# Altium schematic sheet Master-Slave.SchDoc: NEOS Master/Slave Electronics
size D; PageSetup: Record=PageOptions|CenterHorizontal=True|CenterVertical=True|PrintScale=0.34|XCorrection=1.00|YCorrection=1.00|PrintKind=1|BorderSize=5000000|LeftOffset=0|BottomOffset=0|Orientation=2|PaperLength=1000|PaperWidth=1000|Scale=100|PaperSource=15|PrintQuality=1200|MediaType=1|DitherType=10|PaperKind=Letter|PrintScaleMode=1
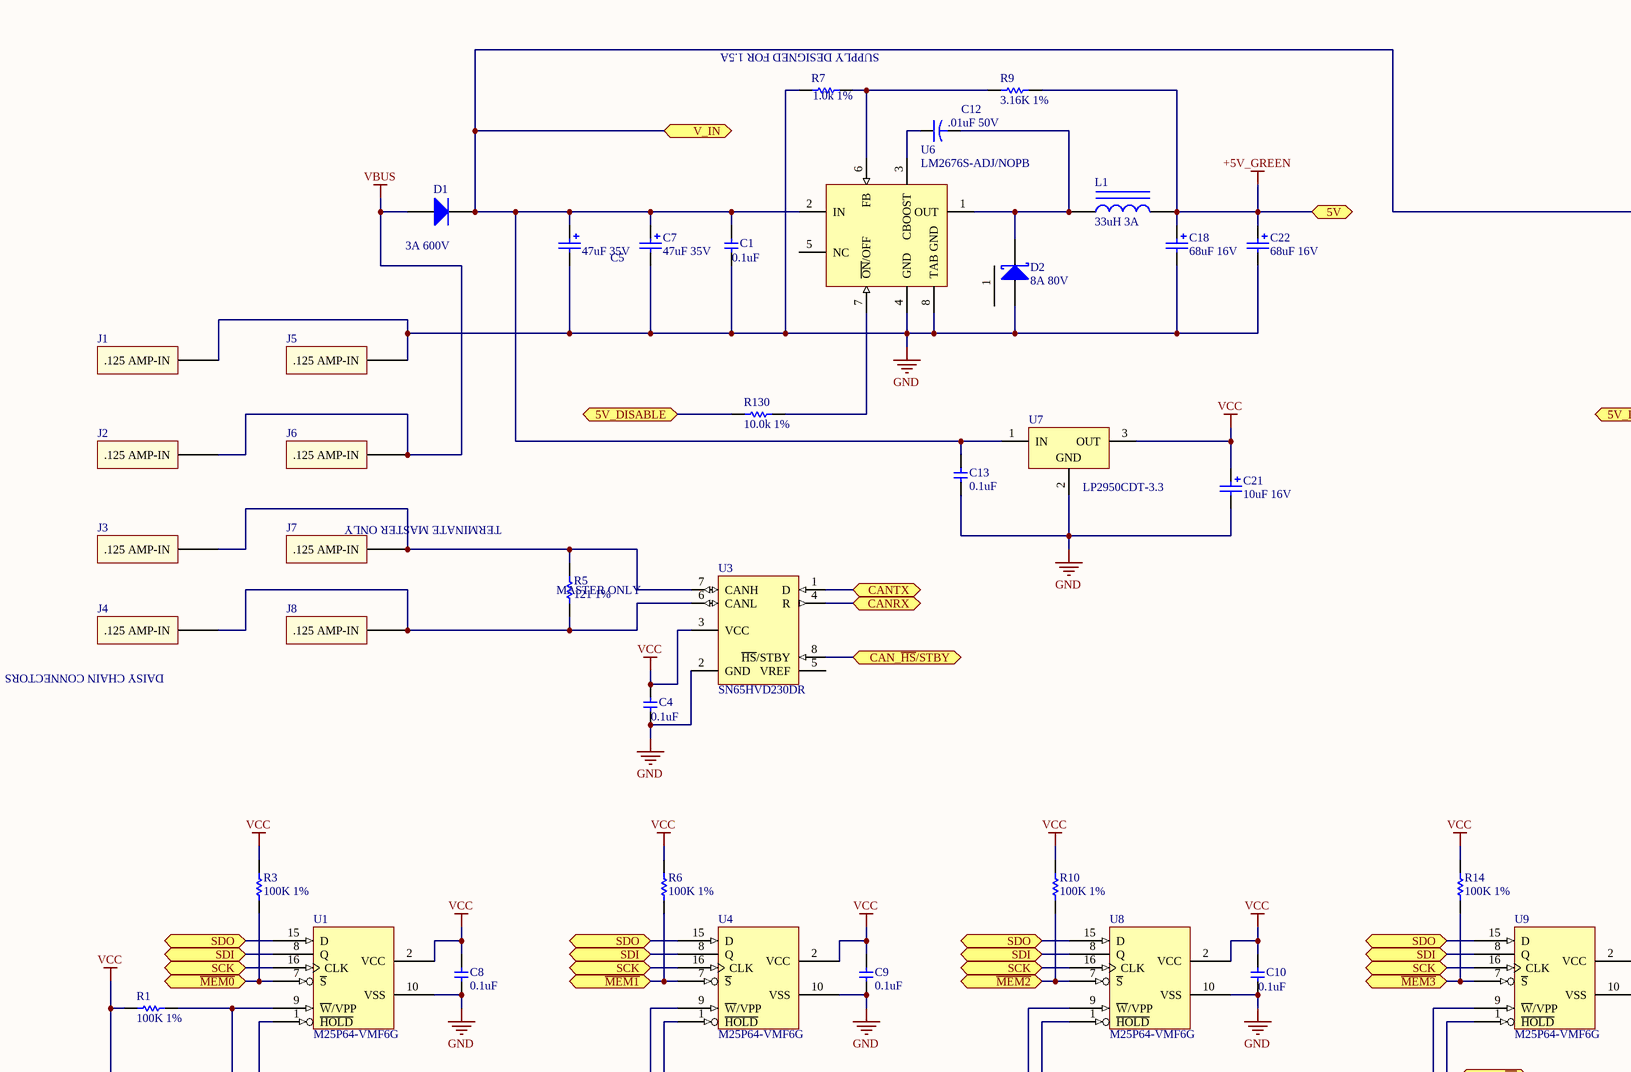
[diagram p0: Master-Slave.SchDoc, top left]
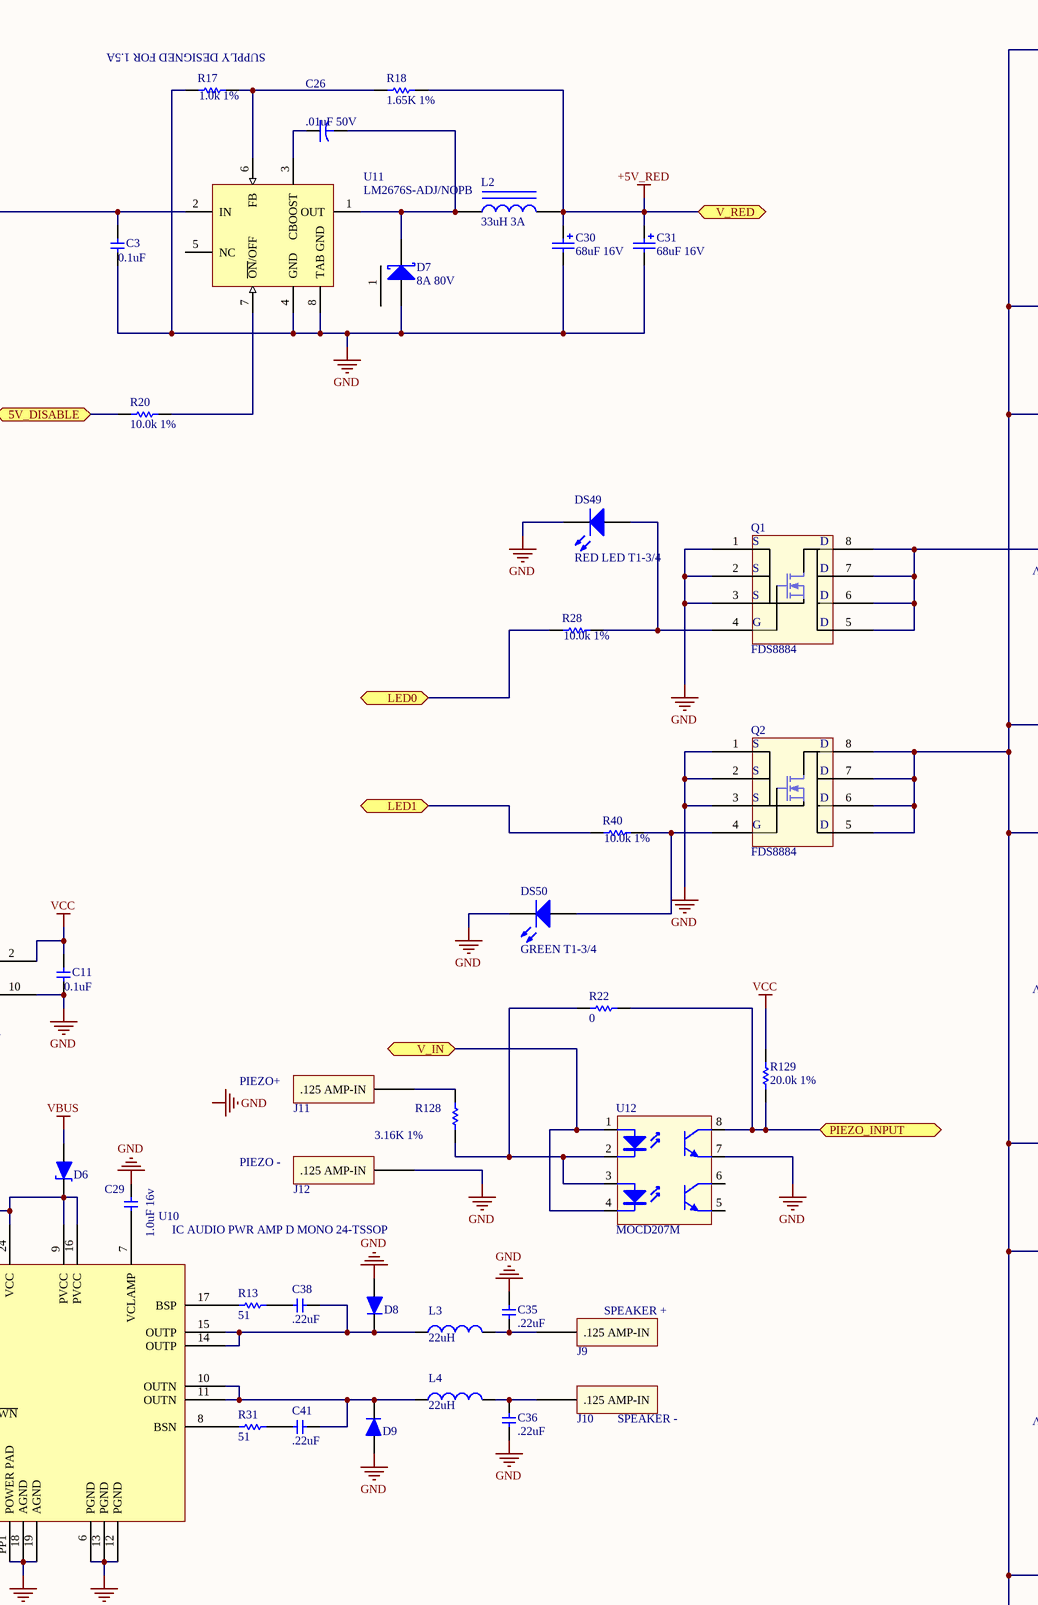
[diagram p1: Master-Slave.SchDoc, top middle]
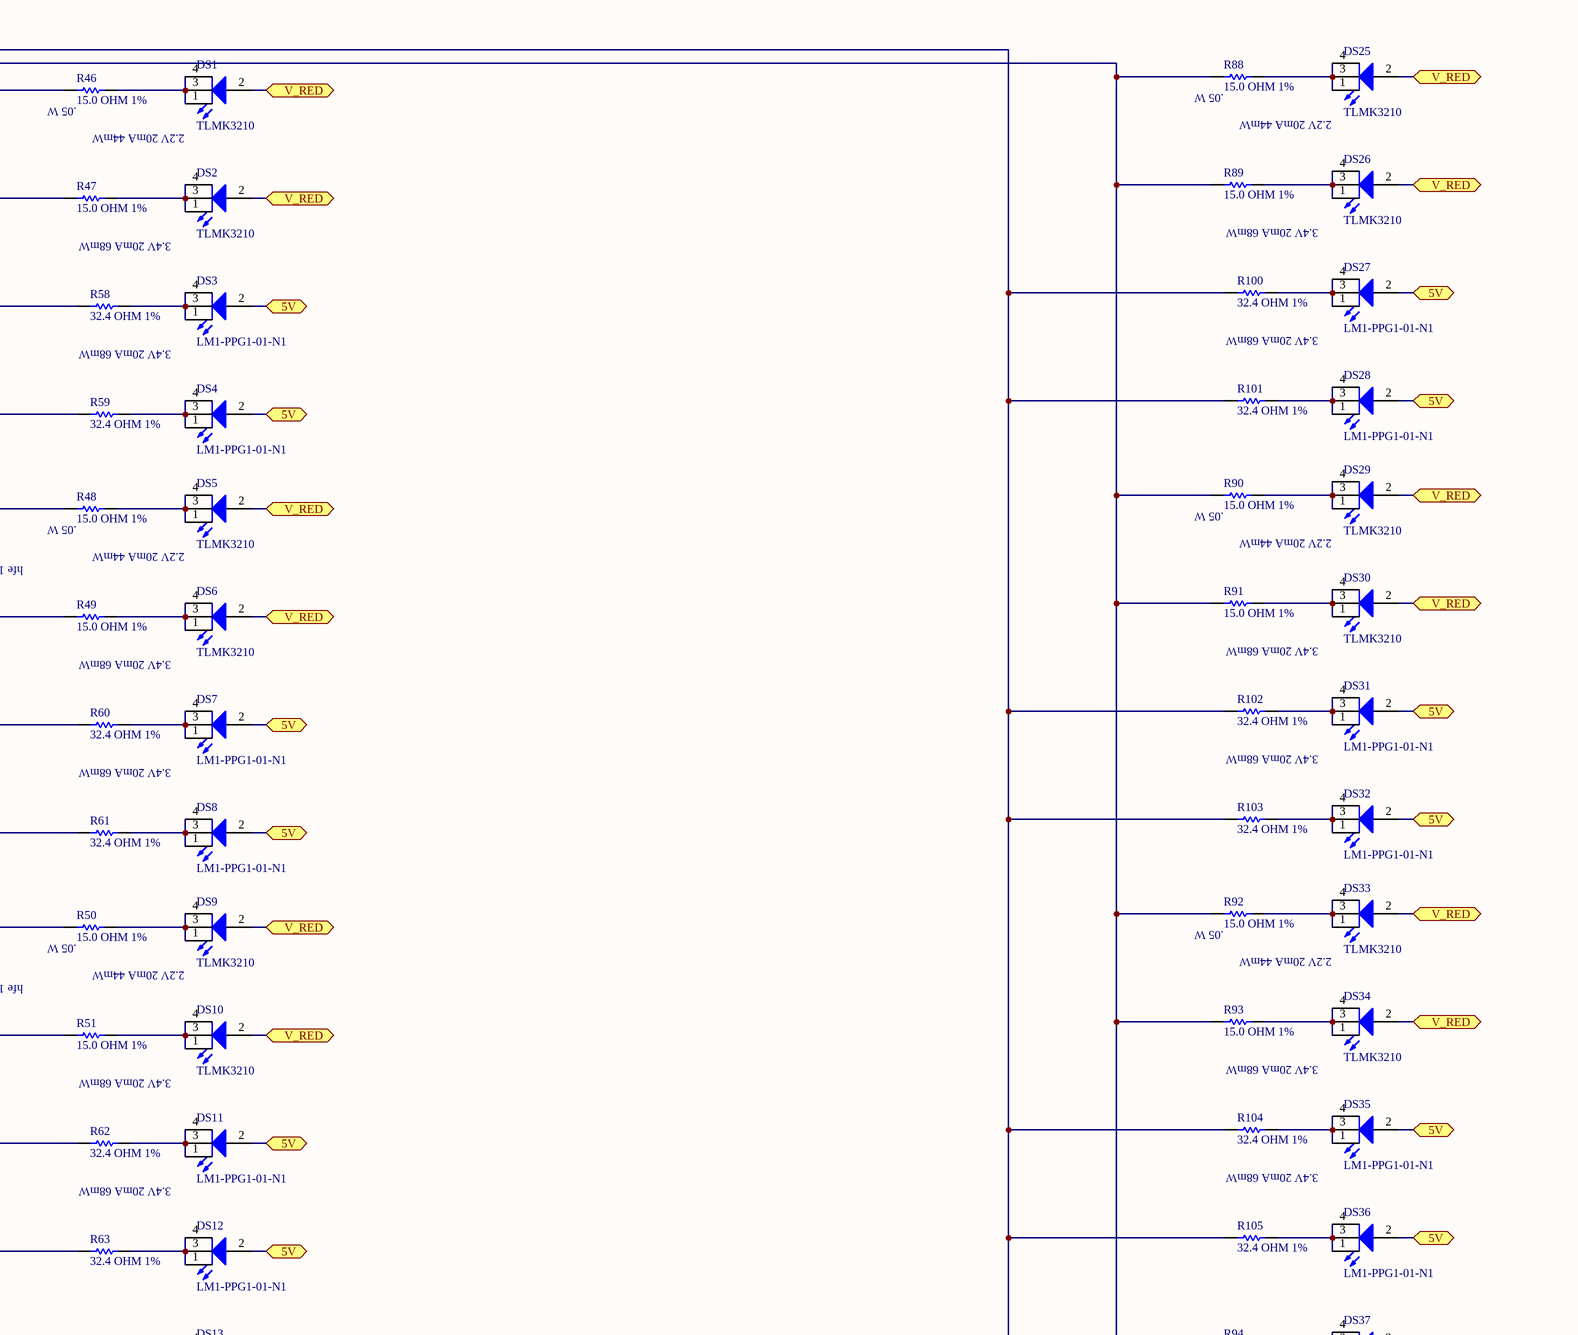
[diagram p2: Master-Slave.SchDoc, top right]
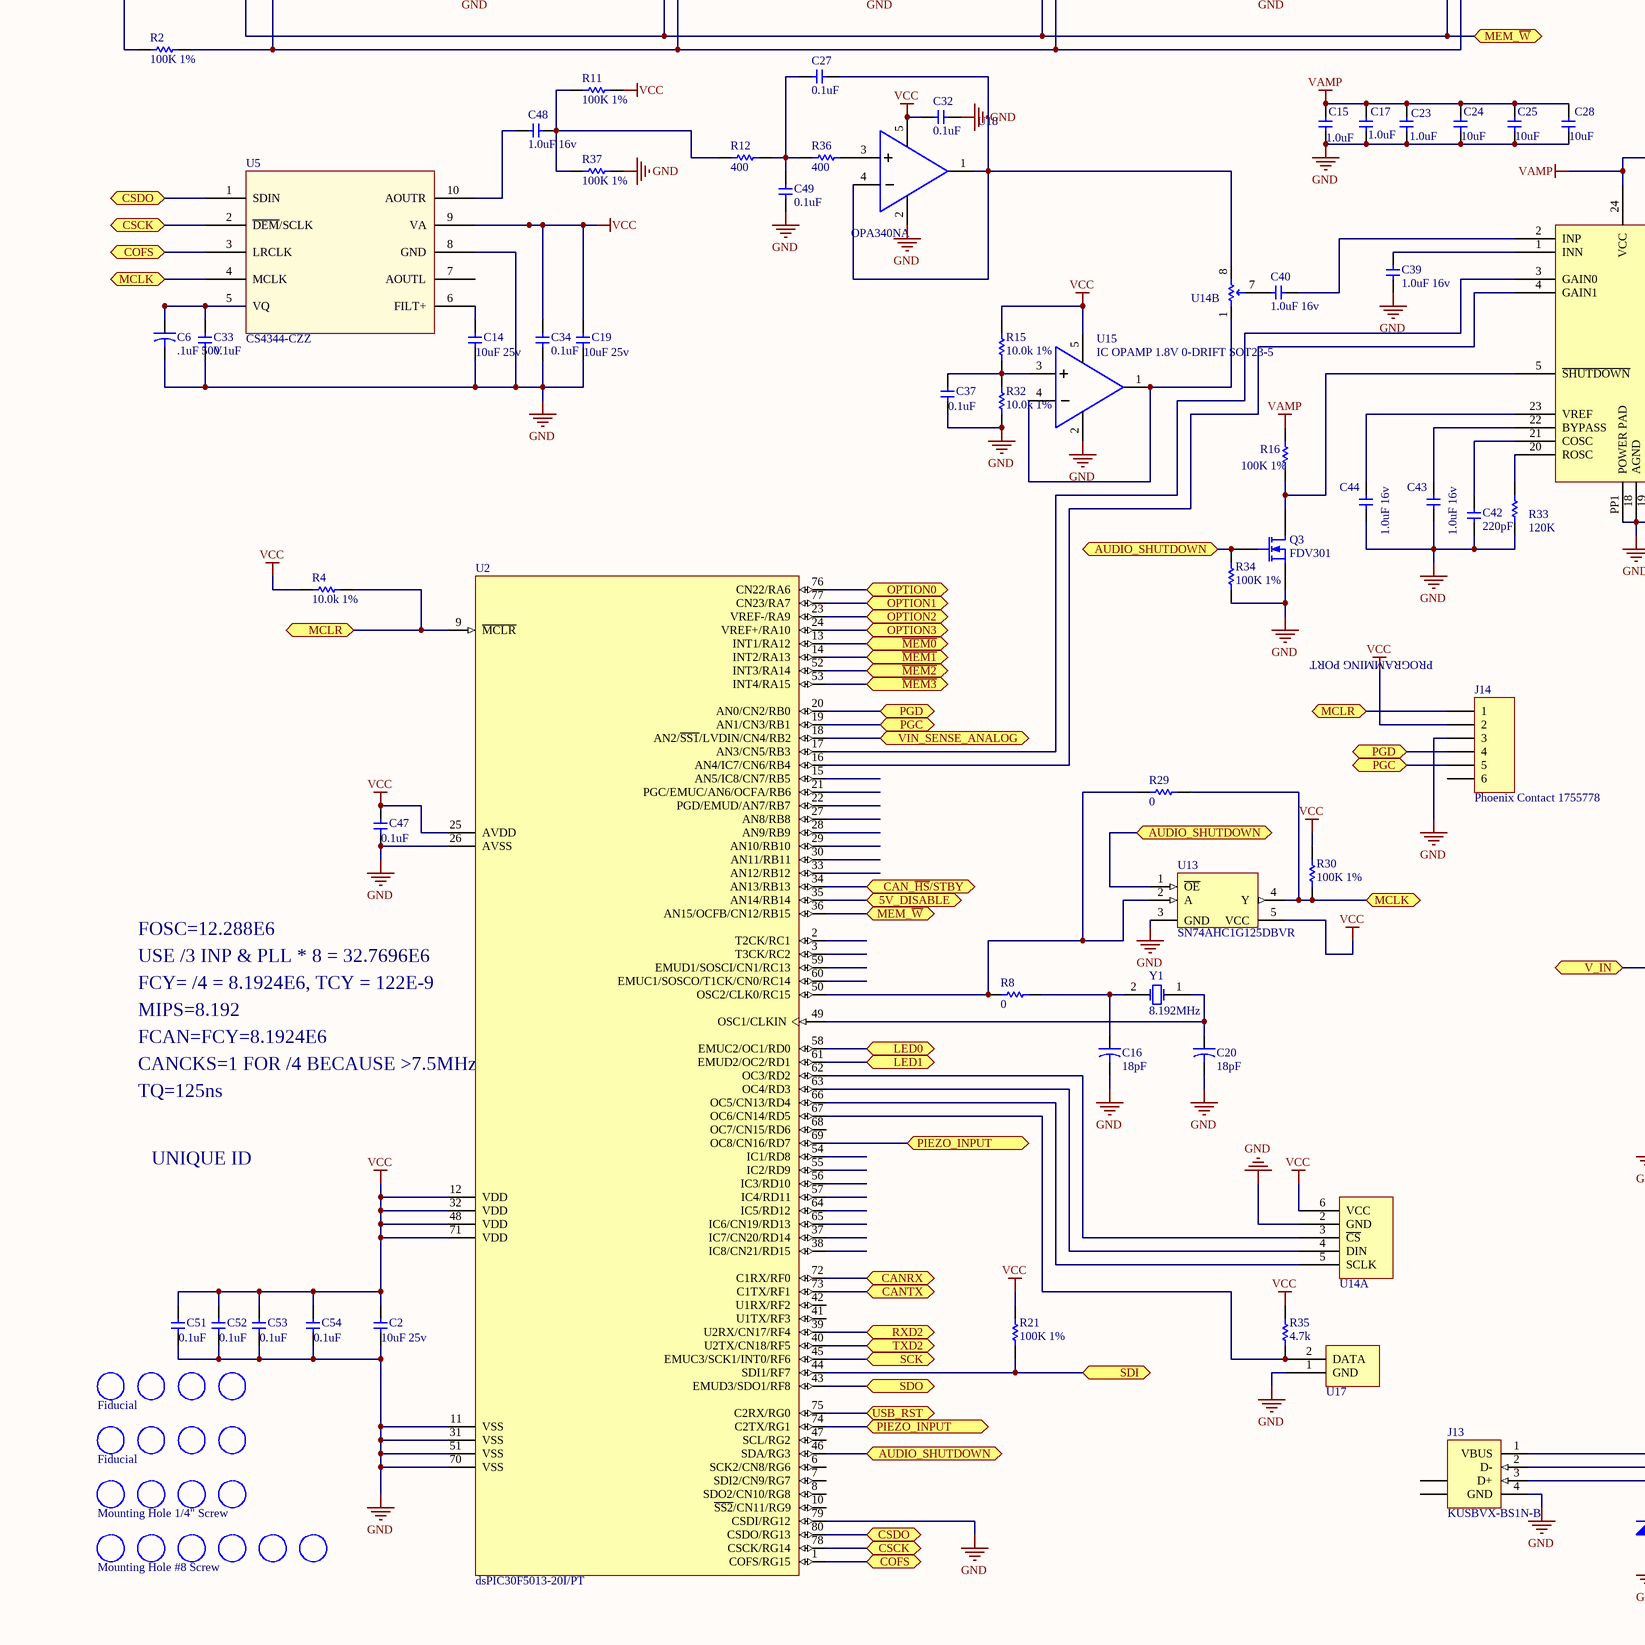
[diagram p3: Master-Slave.SchDoc, bottom left]
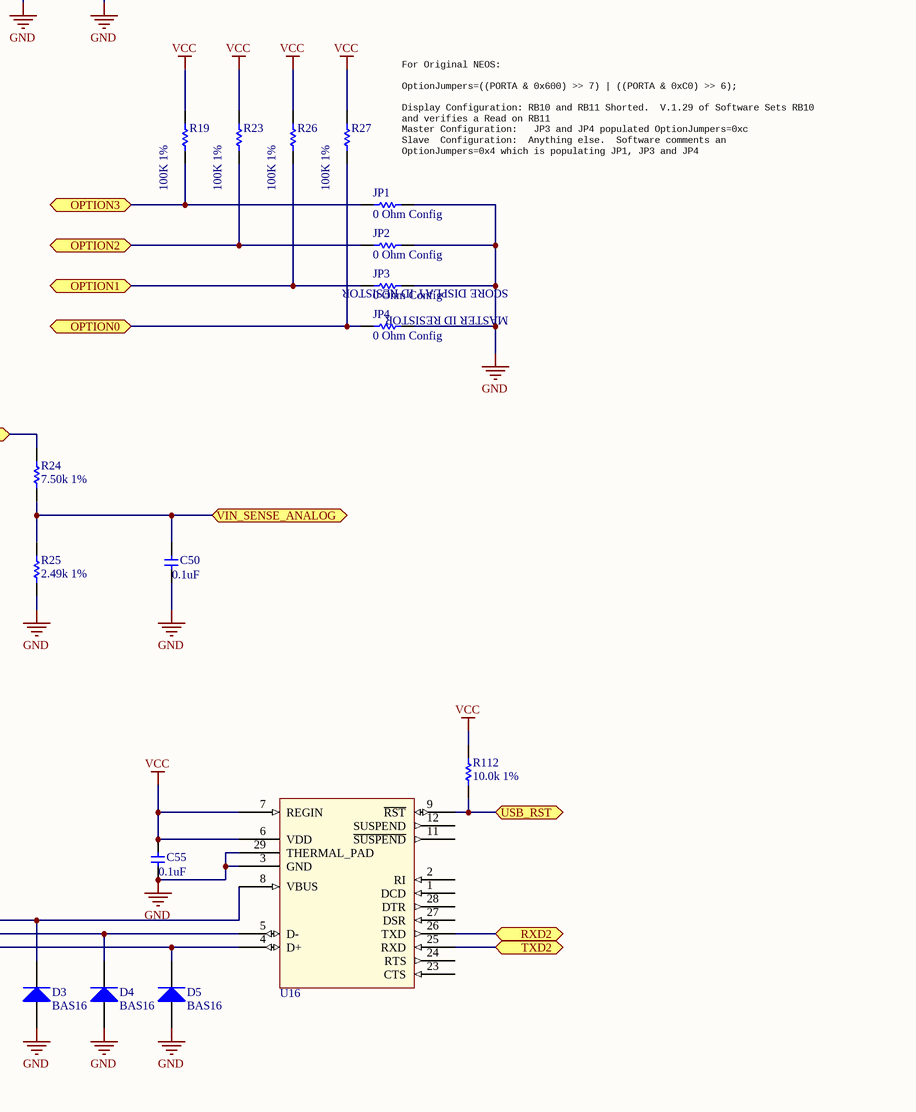
[diagram p4: Master-Slave.SchDoc, bottom middle]
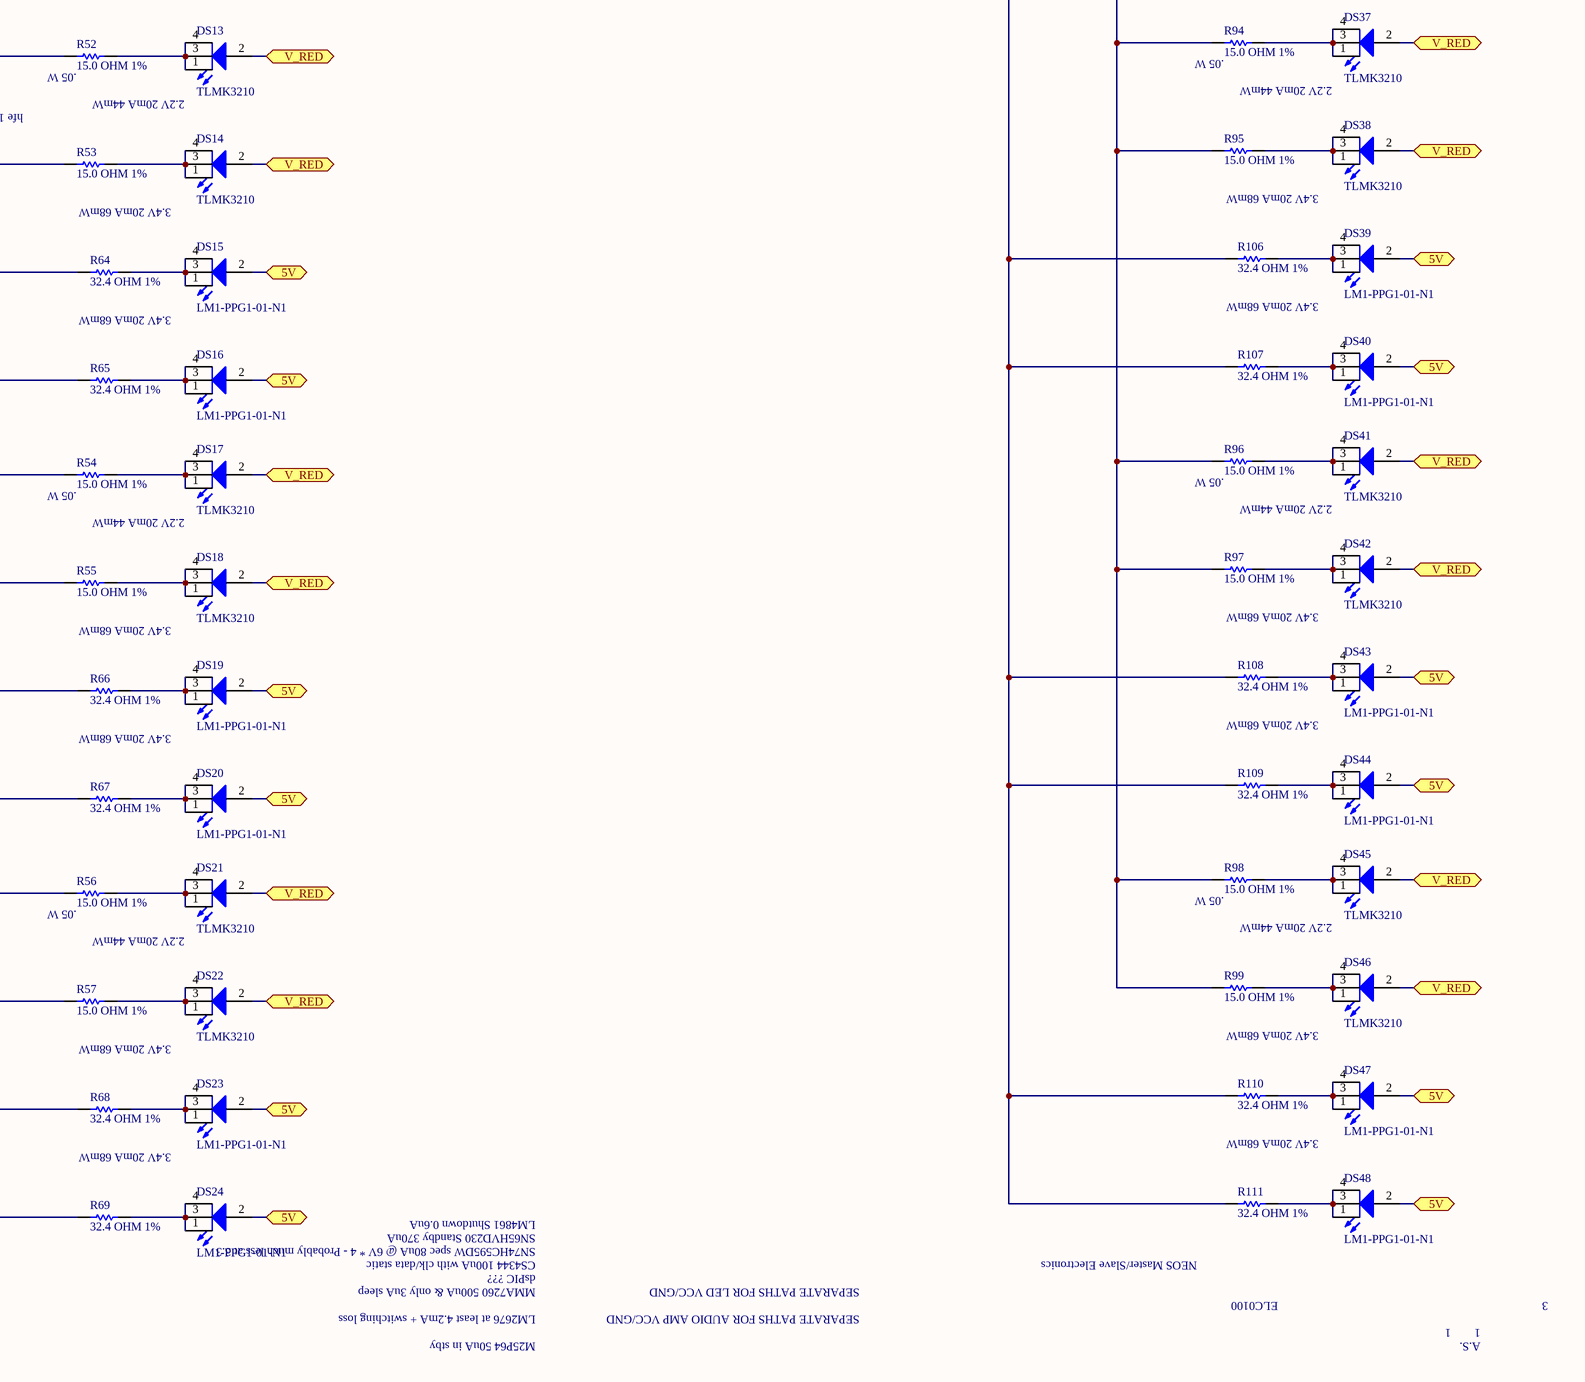
[diagram p5: Master-Slave.SchDoc, bottom right]

## Parts
C1  value 0.1uF  [C0603]  (hidden comment: CAP CER .1UF 25V 10% X7R 0603)
C2  value 10uF 25v  [C1206]  (hidden comment: CAP CER 10UF 25V X5R 1206)
C3  value 0.1uF  [C0603]  (hidden comment: CAP CER .1UF 25V 10% X7R 0603)
C4  value 0.1uF  [C0603]  (hidden comment: CAP CER .1UF 25V 10% X7R 0603)
C5  47uF 35V  [CAPACITOR TANT 47UF 35V 10% SMD 7343-43 (EIA]
C6  .1uF 50V  [C0805]
C7  47uF 35V  [CAPACITOR TANT 47UF 35V 10% SMD 7343-43 (EIA]
C8  value 0.1uF  [C0603]  (hidden comment: CAP CER .1UF 25V 10% X7R 0603)
C9  value 0.1uF  [C0603]  (hidden comment: CAP CER .1UF 25V 10% X7R 0603)
C10  value 0.1uF  [C0603]  (hidden comment: CAP CER .1UF 25V 10% X7R 0603)
C11  value 0.1uF  [C0603]  (hidden comment: CAP CER .1UF 25V 10% X7R 0603)
C12  .01uF 50V  [C0805]
C13  value 0.1uF  [C0603]  (hidden comment: CAP CER .1UF 25V 10% X7R 0603)
C14  value 10uF 25v  [C1206]  (hidden comment: CAP CER 10UF 25V X5R 1206)
C15  value 1.0uF  [C0805]  (hidden comment: CAP CER 1.0UF 16V 20% X7R 08055)
C16  18pF  [C0805]
C17  value 1.0uF  [C0805]  (hidden comment: CAP CER 1.0UF 16V 20% X7R 08055)
C18  68uF 16V  [C7343]
C19  value 10uF 25v  [C1206]  (hidden comment: CAP CER 10UF 25V X5R 1206)
C20  18pF  [C0805]
C21  10uF 16V  [C4X5.8]
C22  68uF 16V  [C7343]
C23  value 1.0uF  [C0805]  (hidden comment: CAP CER 1.0UF 16V 20% X7R 08055)
C24  value 10uF  [C1206]  (hidden comment: CAP CER 10UF 25V X5R 1206)
C25  value 10uF  [C1206]  (hidden comment: CAP CER 10UF 25V X5R 1206)
C26  .01uF 50V  [C0805]
C27  value 0.1uF  [C0603]  (hidden comment: CAP CER .1UF 25V 10% X7R 0603)
C28  value 10uF  [C1206]  (hidden comment: CAP CER 10UF 25V X5R 1206)
C29  value 1.0uF 16v  [C0805]  (hidden comment: CAP CER 1.0UF 16V 20% X7R 08055)
C30  68uF 16V  [D]
C31  68uF 16V  [C7343]
C32  value 0.1uF  [C0603]  (hidden comment: CAP CER .1UF 25V 10% X7R 0603)
C33  value 0.1uF  [C0603]  (hidden comment: CAP CER .1UF 25V 10% X7R 0603)
C34  value 0.1uF  [C0603]  (hidden comment: CAP CER .1UF 25V 10% X7R 0603)
C35  value .22uF  [C0805]  (hidden comment: CAP .22UF 25V CERAMIC X7R 0805)
C36  value .22uF  [C0805]  (hidden comment: CAP .22UF 25V CERAMIC X7R 0805)
C37  value 0.1uF  [C0603]  (hidden comment: CAP CER .1UF 25V 10% X7R 0603)
C38  value .22uF  [C0805]  (hidden comment: CAP .22UF 25V CERAMIC X7R 0805)
C39  value 1.0uF 16v  [C0805]  (hidden comment: CAP CER 1.0UF 16V 20% X7R 08055)
C40  value 1.0uF 16v  [C0805]  (hidden comment: CAP CER 1.0UF 16V 20% X7R 08055)
C41  value .22uF  [C0805]  (hidden comment: CAP .22UF 25V CERAMIC X7R 0805)
C42  value 220pF  [C0603]  (hidden comment: CAP CER 220PF 50V 5% C0G 0603)
C43  value 1.0uF 16v  [C0805]  (hidden comment: CAP CER 1.0UF 16V 20% X7R 08055)
C44  value 1.0uF 16v  [C0805]  (hidden comment: CAP CER 1.0UF 16V 20% X7R 08055)
C47  value 0.1uF  [C0603]  (hidden comment: CAP CER .1UF 25V 10% X7R 0603)
C48  value 1.0uF 16v  [C0805]  (hidden comment: CAP CER 1.0UF 16V 20% X7R 08055)
C49  value 0.1uF  [C0603]  (hidden comment: CAP CER .1UF 25V 10% X7R 0603)
C50  value 0.1uF  [C0603]  (hidden comment: CAP CER .1UF 25V 10% X7R 0603)
C51  value 0.1uF  [C0603]  (hidden comment: CAP CER .1UF 25V 10% X7R 0603)
C52  value 0.1uF  [C0603]  (hidden comment: CAP CER .1UF 25V 10% X7R 0603)
C53  value 0.1uF  [C0603]  (hidden comment: CAP CER .1UF 25V 10% X7R 0603)
C54  value 0.1uF  [C0603]  (hidden comment: CAP CER .1UF 25V 10% X7R 0603)
C55  value 0.1uF  [C0603]  (hidden comment: CAP CER .1UF 25V 10% X7R 0603)
D1  value 3A 600V  [DIODE_SMC]  (hidden comment: DIODE ULTRA FAST 3A 600V SMC)
D2  8A 80V  [D2PAK]
D3  BAS16  [SOT23]
D4  BAS16  [SOT23]
D5  BAS16  [SOT23]
D6  DIODE SCHOTTKY 3A 50V SMA  [SMA]  (value not drawn)
D7  8A 80V  [D2PAK]
D8  DIODE ULTRA FAST 2A 100V SMA  [SMA]  (value not drawn)
D9  DIODE ULTRA FAST 2A 100V SMA  [SMA]  (value not drawn)
DS1  TLMK3210  [L#S/TLMK3210Z]
DS2  TLMK3210  [L#S/TLMK3210Z]
DS3  LM1-PPG1-01-N1  [L#S/TLMK3210Z]
DS4  LM1-PPG1-01-N1  [L#S/TLMK3210Z]
DS5  TLMK3210  [L#S/TLMK3210Z]
DS6  TLMK3210  [L#S/TLMK3210Z]
DS7  LM1-PPG1-01-N1  [L#S/TLMK3210Z]
DS8  LM1-PPG1-01-N1  [L#S/TLMK3210Z]
DS9  TLMK3210  [L#S/TLMK3210Z]
DS10  TLMK3210  [L#S/TLMK3210Z]
DS11  LM1-PPG1-01-N1  [L#S/TLMK3210Z]
DS12  LM1-PPG1-01-N1  [L#S/TLMK3210Z]
DS13  TLMK3210  [L#S/TLMK3210Z]
DS14  TLMK3210  [L#S/TLMK3210Z]
DS15  LM1-PPG1-01-N1  [L#S/TLMK3210Z]
DS16  LM1-PPG1-01-N1  [L#S/TLMK3210Z]
DS17  TLMK3210  [L#S/TLMK3210Z]
DS18  TLMK3210  [L#S/TLMK3210Z]
DS19  LM1-PPG1-01-N1  [L#S/TLMK3210Z]
DS20  LM1-PPG1-01-N1  [L#S/TLMK3210Z]
DS21  TLMK3210  [L#S/TLMK3210Z]
DS22  TLMK3210  [L#S/TLMK3210Z]
DS23  LM1-PPG1-01-N1  [L#S/TLMK3210Z]
DS24  LM1-PPG1-01-N1  [L#S/TLMK3210Z]
DS25  TLMK3210  [L#S/TLMK3210Z]
DS26  TLMK3210  [L#S/TLMK3210Z]
DS27  LM1-PPG1-01-N1  [L#S/TLMK3210Z]
DS28  LM1-PPG1-01-N1  [L#S/TLMK3210Z]
DS29  TLMK3210  [L#S/TLMK3210Z]
DS30  TLMK3210  [L#S/TLMK3210Z]
DS31  LM1-PPG1-01-N1  [L#S/TLMK3210Z]
DS32  LM1-PPG1-01-N1  [L#S/TLMK3210Z]
DS33  TLMK3210  [L#S/TLMK3210Z]
DS34  TLMK3210  [L#S/TLMK3210Z]
DS35  LM1-PPG1-01-N1  [L#S/TLMK3210Z]
DS36  LM1-PPG1-01-N1  [L#S/TLMK3210Z]
DS37  TLMK3210  [L#S/TLMK3210Z]
DS38  TLMK3210  [L#S/TLMK3210Z]
DS39  LM1-PPG1-01-N1  [L#S/TLMK3210Z]
DS40  LM1-PPG1-01-N1  [L#S/TLMK3210Z]
DS41  TLMK3210  [L#S/TLMK3210Z]
DS42  TLMK3210  [L#S/TLMK3210Z]
DS43  LM1-PPG1-01-N1  [L#S/TLMK3210Z]
DS44  LM1-PPG1-01-N1  [L#S/TLMK3210Z]
DS45  TLMK3210  [L#S/TLMK3210Z]
DS46  TLMK3210  [L#S/TLMK3210Z]
DS47  LM1-PPG1-01-N1  [L#S/TLMK3210Z]
DS48  LM1-PPG1-01-N1  [L#S/TLMK3210Z]
DS49  RED LED T1-3/4  [LED T1-3/4 Flush]
DS50  GREEN T1-3/4  [LED T1-3/4 Flush]
FID1  Fiducial  [Fiducial]  (no BOM)
FID2  Fiducial  [Fiducial]  (value not drawn)  (no BOM)
FID3  Fiducial  [Fiducial]  (value not drawn)  (no BOM)
FID4  Fiducial  [Fiducial]  (value not drawn)  (no BOM)
FID5  Fiducial  [Fiducial]  (no BOM)
FID6  Fiducial  [Fiducial]  (value not drawn)  (no BOM)
FID7  Fiducial  [Fiducial]  (value not drawn)  (no BOM)
FID8  Fiducial  [Fiducial]  (value not drawn)  (no BOM)
J1  *  [WIRE_125]  (value not drawn)  (no BOM)
J2  *  [WIRE_125]  (value not drawn)  (no BOM)
J3  *  [WIRE_125]  (value not drawn)  (no BOM)
J4  *  [WIRE_125]  (value not drawn)  (no BOM)
J5  *  [WIRE_125]  (value not drawn)  (no BOM)
J6  *  [WIRE_125]  (value not drawn)  (no BOM)
J7  *  [WIRE_125]  (value not drawn)  (no BOM)
J8  *  [WIRE_125]  (value not drawn)  (no BOM)
J9  *  [WIRE_125]  (value not drawn)  (no BOM)
J10  *  [WIRE_125]  (value not drawn)  (no BOM)
J11  *  [WIRE_125]  (value not drawn)  (no BOM)
J12  *  [WIRE_125]  (value not drawn)  (no BOM)
J13  KUSBVX-BS1N-B  [KUSBVX-BS1N]
J14  Phoenix Contact 1755778  [JCPM5086VE0Z]
JP1  0 Ohm Config
JP2  0 Ohm Config
JP3  0 Ohm Config
JP4  0 Ohm Config  [0805]
L1  33uH 3A  [IND/DO5022]
L2  33uH 3A  [IND/DO5022]
L3  value 22uH  [PANASONIC_ELL]  (hidden comment: COIL 22UH 900MA CHOKE SMD)
L4  value 22uH  [PANASONIC_ELL]  (hidden comment: COIL 22UH 900MA CHOKE SMD)
M1  Mounting Hole 1/4" Screw  [MHole250]  (no BOM)
M2  Mounting Hole 1/4" Screw  [MHole250]  (value not drawn)  (no BOM)
M3  Mounting Hole 1/4" Screw  [MHole250]  (value not drawn)  (no BOM)
M4  Mounting Hole 1/4" Screw  [MHole250]  (value not drawn)  (no BOM)
M5  Mounting Hole #8 Screw  [MHole#8]  (no BOM)
M6  Mounting Hole #8 Screw  [MHole#8]  (value not drawn)  (no BOM)
M7  Mounting Hole #8 Screw  [MHole#8]  (value not drawn)  (no BOM)
M8  Mounting Hole #8 Screw  [MHole#8]  (value not drawn)  (no BOM)
M9  Mounting Hole #8 Screw  [MHole#8]  (value not drawn)  (no BOM)
M10  Mounting Hole #8 Screw  [MHole#8]  (value not drawn)  (no BOM)
Q1  FDS8884  [SO8]
Q2  FDS8884  [SO8]
Q3  FDV301  [SOT95P245X145-3L]
R1  100K 1%  [R0805]
R2  100K 1%  [R0805]
R3  100K 1%  [R0805]
R4  10.0k 1%  [R0805]
R5  121 1%  [R1206]
R6  100K 1%  [R0805]
R7  1.0k 1%  [R0805]
R8  0  [R0805]
R9  3.16K 1%  [R0805]
R10  100K 1%  [R0805]
R11  100K 1%  [R0805]
R12  400  [R0805]
R13  value 51  [R0805]  (hidden comment: RES 51.0 OHM 1/8W 1% 0805 SMD)
R14  100K 1%  [R0805]
R15  10.0k 1%  [R0805]
R16  100K 1%  [R0805]
R17  1.0k 1%  [R0805]
R18  1.65K 1%  [R0805]
R19  100K 1%  [R0805]
R20  10.0k 1%  [R0805]
R21  100K 1%  [R0805]
R22  0  [R0805]
R23  100K 1%  [R0805]
R24  7.50k 1%  [R0805]
R25  2.49k 1%
R26  100K 1%  [R0805]
R27  100K 1%  [R0805]
R28  10.0k 1%  [R0805]
R29  0  [R0805]
R30  100K 1%  [R0805]
R31  value 51  [R0805]  (hidden comment: RES 51.0 OHM 1/8W 1% 0805 SMD)
R32  10.0k 1%  [R0805]
R33  value 120K  [R0805]  (hidden comment: RES 120K OHM 1/8W 5% 0805 SMD)
R34  100K 1%  [R0805]
R35  4.7k  [R0805]
R36  400  [R0805]
R37  100K 1%  [R0805]
R40  10.0k 1%  [R0805]
R46  15.0 OHM 1%  [R1206]
R47  15.0 OHM 1%  [R1206]
R48  15.0 OHM 1%  [R1206]
R49  15.0 OHM 1%  [R1206]
R50  15.0 OHM 1%  [R1206]
R51  15.0 OHM 1%  [R1206]
R52  15.0 OHM 1%  [R1206]
R53  15.0 OHM 1%  [R1206]
R54  15.0 OHM 1%  [R1206]
R55  15.0 OHM 1%  [R1206]
R56  15.0 OHM 1%  [R1206]
R57  15.0 OHM 1%  [R1206]
R58  32.4 OHM 1%  [R1206]
R59  32.4 OHM 1%  [R1206]
R60  32.4 OHM 1%  [R1206]
R61  32.4 OHM 1%  [R1206]
R62  32.4 OHM 1%  [R1206]
R63  32.4 OHM 1%  [R1206]
R64  32.4 OHM 1%  [R1206]
R65  32.4 OHM 1%  [R1206]
R66  32.4 OHM 1%  [R1206]
R67  32.4 OHM 1%  [R1206]
R68  32.4 OHM 1%  [R1206]
R69  32.4 OHM 1%  [R1206]
R88  15.0 OHM 1%  [R1206]
R89  15.0 OHM 1%  [R1206]
R90  15.0 OHM 1%  [R1206]
R91  15.0 OHM 1%  [R1206]
R92  15.0 OHM 1%  [R1206]
R93  15.0 OHM 1%  [R1206]
R94  15.0 OHM 1%  [R1206]
R95  15.0 OHM 1%  [R1206]
R96  15.0 OHM 1%  [R1206]
R97  15.0 OHM 1%  [R1206]
R98  15.0 OHM 1%  [R1206]
R99  15.0 OHM 1%  [R1206]
R100  32.4 OHM 1%  [R1206]
R101  32.4 OHM 1%  [R1206]
R102  32.4 OHM 1%  [R1206]
R103  32.4 OHM 1%  [R1206]
R104  32.4 OHM 1%  [R1206]
R105  32.4 OHM 1%  [R1206]
R106  32.4 OHM 1%  [R1206]
R107  32.4 OHM 1%  [R1206]
R108  32.4 OHM 1%  [R1206]
R109  32.4 OHM 1%  [R1206]
R110  32.4 OHM 1%  [R1206]
R111  32.4 OHM 1%  [R1206]
R112  10.0k 1%  [R0805]
R128  3.16K 1%  [R0805]
R129  20.0k 1%  [R0805]
R130  10.0k 1%  [R0805]
U1  M25P64-VMF6G  [so16w]
U2  dsPIC30F5013-20I/PT  [TQFP-80]
U3  SN65HVD230DR  [SOIC 8]
U4  M25P64-VMF6G  [so16w]
U5  CS4344-CZZ  [TSSOP\10]
U6  LM2676S-ADJ/NOPB  [TO263\7]
U7  LP2950CDT-3.3  [D-PAK / TO-252AA]
U8  M25P64-VMF6G  [so16w]
U9  M25P64-VMF6G  [so16w]
U10  IC AUDIO PWR AMP D MONO 24-TSSOP  [HTSSOP-24]
U11  LM2676S-ADJ/NOPB  [TO263\7]
U12  MOCD207M  [SOIC 8]
U13  SN74AHC1G125DBVR  [SOT23-5]
U14  IC DIGITAL POT 256-TAP SOT23-8  [SOT95P245X110-*L]  (value not drawn)  (parts A,B of 2)
U15  IC OPAMP 1.8V 0-DRIFT SOT23-5  [SOT95P245X145-5L]
U16  IC USB-TO-UART BRIDGE 28MLP  [QFN-28]  (value not drawn)
U17  IC SILICON SERIAL NUMBER 6-TSOC  [TSOC6]  (value not drawn)
U18  value OPA340NA  [SOT95P245X145-5L]  (hidden comment: IC SINGLE SUPPLY OPAMP SOT-23-5)
Y1  8.192MHz  [XTSL\CSM-7]

## Ports
5V, 5V_DISABLE, AUDIO_SHUTDOWN (bidir), CAN_~{HS}/STBY, CANRX, CANTX, COFS, CSCK, CSDO, LED0, LED1, MCLK, MCLR, MEM_~{W}, OPTION0, OPTION1, OPTION2, OPTION3, PGC, PGD, PIEZO_INPUT, RXD2, SCK, SDI, SDO, TXD2, USB_RST, V_IN, V_RED, VIN_SENSE_ANALOG, ~{MEM0}, ~{MEM1}, ~{MEM2}, ~{MEM3}

## Nets
+5V_GREEN: C18.1 C22.1 DS3.2(A) DS4.2(A) DS7.2(A) DS8.2(A) DS11.2(A) DS12.2(A) DS15.2(A) DS16.2(A) DS19.2(A) DS20.2(A) DS23.2(A) DS24.2(A) DS27.2(A) DS28.2(A) DS31.2(A) DS32.2(A) DS35.2(A) DS36.2(A) DS39.2(A) DS40.2(A) DS43.2(A) DS44.2(A) DS47.2(A) DS48.2(A) L1.2 R9.2 ; port 5V
+5V_RED: C30.1 C31.1 DS1.2(A) DS2.2(A) DS5.2(A) DS6.2(A) DS9.2(A) DS10.2(A) DS13.2(A) DS14.2(A) DS17.2(A) DS18.2(A) DS21.2(A) DS22.2(A) DS25.2(A) DS26.2(A) DS29.2(A) DS30.2(A) DS33.2(A) DS34.2(A) DS37.2(A) DS38.2(A) DS41.2(A) DS42.2(A) DS45.2(A) DS46.2(A) L2.2 R18.2 ; port V_RED
GND: C1.1 C2.1 C3.1 C4.1 C5.2 C6.2 C7.2 C8.2 C9.2 C10.1 C11.1 C13.2 C14.1 C15.1 C16.2 C17.1 C18.2 C19.1 C20.2 C21.2 C22.2 C23.1 C24.1 C25.1 C28.1 C29.2 C30.2 C31.2 C32.1 C33.2 C34.2 C35.2 C36.1 C37.1 C39.2 C42.2 C43.1 C44.1 C47.1 C49.2 C50.1 C51.1 C52.1 C53.1 C54.1 C55.1 D2.3(A) D3.1(A) D4.1(A) D5.1(A) D7.3(A) D8.A D9.A DS49.2(K) DS50.2(K) J1.1(.125_AMP-IN) J5.1(.125_AMP-IN) J12.1(.125_AMP-IN) J13.4(GND) J14.3 JP1.2 JP2.2 JP3.2 JP4.2 Q1.1(S) Q1.2(S) Q1.3(S) Q2.1(S) Q2.2(S) Q2.3(S) Q3.2(S) R7.1 R17.1 R25.1 R32.1 R33.1 R34.1 R37.1 U1.10(VSS) U2.11(VSS) U2.26(AVSS) U2.31(VSS) U2.51(VSS) U2.70(VSS) U2.79(CSDI/RG12) U3.2(GND) U4.10(VSS) U5.8(GND) U6.4(GND) U6.8(TAB_GND) U7.2(GND) U8.10(VSS) U9.10(VSS) U10.6(PGND) U10.12(PGND) U10.13(PGND) U10.18(AGND) U10.19(AGND) U10.PP1(POWER_PAD) U11.4(GND) U11.8(TAB_GND) U12.7 U13.3(GND) U14.2(GND) U15.2(GND) U16.3(GND) U16.29(THERMAL_PAD) U17.1(GND) U18.2(GND)
VAMP: C15.2 C17.2 C23.2 C24.2 C25.2 C28.2 D6.C R16.2 U10.9(PVCC) U10.16(PVCC) U10.24(VCC)
VBUS: D1.A D6.A J2.1(.125_AMP-IN) J6.1(.125_AMP-IN)
VCC: C2.2 C4.2 C8.1 C9.1 C10.2 C11.2 C19.2 C21.1 C32.2 C34.1 C47.2 C51.2 C52.2 C53.2 C54.2 C55.2 J14.2 R1.1 R2.1 R3.2 R4.2 R6.2 R10.2 R11.1 R14.2 R15.2 R19.2 R21.2 R23.2 R26.2 R27.2 R30.2 R35.1 R112.2 R129.2 U1.2(VCC) U2.12(VDD) U2.25(AVDD) U2.32(VDD) U2.48(VDD) U2.71(VDD) U3.3(VCC) U4.2(VCC) U5.9(VA) U7.3(OUT) U8.2(VCC) U9.2(VCC) U13.5(VCC) U14.6(VCC) U15.5(VCC) U16.6(VDD) U16.7(REGIN) U18.5(VCC)
5V_DISABLE: R20.1 R130.1 U2.35(AN14/RB14) ; port 5V_DISABLE
AUDIO_SHUTDOWN: Q3.1(G) R34.2 U2.46(SDA/RG3) U13.1(~{OE}) ; port AUDIO_SHUTDOWN
CAN_~{HS}/STBY: U2.34(AN13/RB13) U3.8(~{HS}/STBY) ; port CAN_~{HS}/STBY
CANRX: U2.72(C1RX/RF0) U3.4(R) ; port CANRX
CANTX: U2.73(C1TX/RF1) U3.1(D) ; port CANTX
COFS: U2.1(COFS/RG15) U5.3(LRCLK) ; port COFS
CSCK: U2.78(CSCK/RG14) U5.2(~{DEM}/SCLK) ; port CSCK
CSDO: U2.80(CSDO/RG13) U5.1(SDIN) ; port CSDO
LED0: R28.1 U2.58(EMUC2/OC1/RD0) ; port LED0
LED1: R40.1 U2.61(EMUD2/OC2/RD1) ; port LED1
~{MEM0}: R3.1 U1.7(~{S}) U2.13(INT1/RA12) ; port ~{MEM0}
~{MEM1}: R6.1 U2.14(INT2/RA13) U4.7(~{S}) ; port ~{MEM1}
~{MEM2}: R10.1 U2.52(INT3/RA14) U8.7(~{S}) ; port ~{MEM2}
~{MEM3}: R14.1 U2.53(INT4/RA15) U9.7(~{S}) ; port ~{MEM3}
MCLK: R29.2 R30.1 U5.4(MCLK) U13.4(Y) ; port MCLK
MCLR: J14.1 R4.1 U2.9(~{MCLR}) ; port MCLR
MEM_~{W}: R1.2 U1.9(~{W}/VPP) U2.36(AN15/OCFB/CN12/RB15) U4.9(~{W}/VPP) U8.9(~{W}/VPP) U9.9(~{W}/VPP) ; port MEM_~{W}
OPTION0: JP4.1 R27.1 U2.76(CN22/RA6) ; port OPTION0
OPTION1: JP3.1 R26.1 U2.77(CN23/RA7) ; port OPTION1
OPTION2: JP2.1 R23.1 U2.23(VREF-/RA9) ; port OPTION2
OPTION3: JP1.1 R19.1 U2.24(VREF+/RA10) ; port OPTION3
PGC: J14.5 U2.19(AN1/CN3/RB1) ; port PGC
PGD: J14.4 U2.20(AN0/CN2/RB0) ; port PGD
PIEZO_INPUT: R22.2 R129.1 U2.69(OC8/CN16/RD7) U2.74(C2TX/RG1) U12.8 ; port PIEZO_INPUT
RXD2: U2.39(U2RX/CN17/RF4) U16.26(TXD) ; port RXD2
SCK: U1.16(CLK) U2.45(EMUC3/SCK1/INT0/RF6) U4.16(CLK) U8.16(CLK) U9.16(CLK) ; port SCK
SDI: R21.1 U1.8(Q) U2.44(SDI1/RF7) U4.8(Q) U8.8(Q) U9.8(Q) ; port SDI
SDO: U1.15(D) U2.43(EMUD3/SDO1/RF8) U4.15(D) U8.15(D) U9.15(D) ; port SDO
TXD2: U2.40(U2TX/CN18/RF5) U16.25(RXD) ; port TXD2
USB_RST: R112.1 U2.75(C2RX/RG0) U16.9(~{RST}) ; port USB_RST
V_IN: C1.2 C3.2 C5.1 C7.1 C13.1 D1.K R24.2 U6.2(IN) U7.1(IN) U11.2(IN) U12.1 U12.4 ; port V_IN
VIN_SENSE_ANALOG: C50.2 R24.1 R25.2 U2.18(AN2/~{SS1}/LVDIN/CN4/RB2) ; port VIN_SENSE_ANALOG
NetC6_1: C6.1 C33.1 U5.5(VQ)
NetC12_1: C12.1 U6.3(CBOOST)
NetC12_2: C12.2 D2.2(K) L1.1 U6.1(OUT)
NetC14_2: C14.2 U5.6(FILT+)
NetC16_1: C16.1 R8.2 Y1.2(OSC2)
NetC20_1: C20.1 U2.49(OSC1/CLKIN) Y1.1(OSC1)
NetC26_1: C26.1 U11.3(CBOOST)
NetC26_2: C26.2 D7.2(K) L2.1 U11.1(OUT)
NetC27_1: C27.1 U14.8 U18.1(OUT) U18.4(-)
NetC27_2: C27.2 C49.1 R12.2 R36.1
NetC29_1: C29.1 U10.7(VCLAMP)
NetC35_1: C35.1 J9.1(.125_AMP-IN) L3.2
NetC36_2: C36.2 J10.1(.125_AMP-IN) L4.2
NetC37_2: C37.2 R15.1 R32.2 U15.3(+)
NetC38_1: C38.1 R13.1
NetC38_2: C38.2 D8.C L3.1 U10.14(OUTP) U10.15(OUTP)
NetC39_1: C39.1 U10.1(INN)
NetC40_1: C40.1 U10.2(INP)
NetC40_2: C40.2 U14.7
NetC41_1: C41.1 R31.1
NetC41_2: C41.2 D9.C L4.1 U10.10(OUTN) U10.11(OUTN)
NetC42_1: C42.1 U10.21(COSC)
NetC43_2: C43.2 U10.22(BYPASS)
NetC44_2: C44.2 U10.23(VREF)
NetC48_1: C48.1 R11.2 R12.1 R37.2
NetC48_2: C48.2 U5.10(AOUTR)
NetD3_3: D3.3(K) J13.1(VBUS) U16.8(VBUS)
NetD4_3: D4.3(K) J13.2(D-) U16.5(D-)
NetD5_3: D5.3(K) J13.3(D+) U16.4(D+)
NetDS1_1: DS1.1(K) DS1.3(K) DS1.4(K) R46.2
NetDS2_1: DS2.1(K) DS2.3(K) DS2.4(K) R47.2
NetDS3_1: DS3.1(K) DS3.3(K) DS3.4(K) R58.2
NetDS4_1: DS4.1(K) DS4.3(K) DS4.4(K) R59.2
NetDS5_1: DS5.1(K) DS5.3(K) DS5.4(K) R48.2
NetDS6_1: DS6.1(K) DS6.3(K) DS6.4(K) R49.2
NetDS7_1: DS7.1(K) DS7.3(K) DS7.4(K) R60.2
NetDS8_1: DS8.1(K) DS8.3(K) DS8.4(K) R61.2
NetDS9_1: DS9.1(K) DS9.3(K) DS9.4(K) R50.2
NetDS10_1: DS10.1(K) DS10.3(K) DS10.4(K) R51.2
NetDS11_1: DS11.1(K) DS11.3(K) DS11.4(K) R62.2
NetDS12_1: DS12.1(K) DS12.3(K) DS12.4(K) R63.2
NetDS13_1: DS13.1(K) DS13.3(K) DS13.4(K) R52.2
NetDS14_1: DS14.1(K) DS14.3(K) DS14.4(K) R53.2
NetDS15_1: DS15.1(K) DS15.3(K) DS15.4(K) R64.2
NetDS16_1: DS16.1(K) DS16.3(K) DS16.4(K) R65.2
NetDS17_1: DS17.1(K) DS17.3(K) DS17.4(K) R54.2
NetDS18_1: DS18.1(K) DS18.3(K) DS18.4(K) R55.2
NetDS19_1: DS19.1(K) DS19.3(K) DS19.4(K) R66.2
NetDS20_1: DS20.1(K) DS20.3(K) DS20.4(K) R67.2
NetDS21_1: DS21.1(K) DS21.3(K) DS21.4(K) R56.2
NetDS22_1: DS22.1(K) DS22.3(K) DS22.4(K) R57.2
NetDS23_1: DS23.1(K) DS23.3(K) DS23.4(K) R68.2
NetDS24_1: DS24.1(K) DS24.3(K) DS24.4(K) R69.2
NetDS25_1: DS25.1(K) DS25.3(K) DS25.4(K) R88.2
NetDS26_1: DS26.1(K) DS26.3(K) DS26.4(K) R89.2
NetDS27_1: DS27.1(K) DS27.3(K) DS27.4(K) R100.2
NetDS28_1: DS28.1(K) DS28.3(K) DS28.4(K) R101.2
NetDS29_1: DS29.1(K) DS29.3(K) DS29.4(K) R90.2
NetDS30_1: DS30.1(K) DS30.3(K) DS30.4(K) R91.2
NetDS31_1: DS31.1(K) DS31.3(K) DS31.4(K) R102.2
NetDS32_1: DS32.1(K) DS32.3(K) DS32.4(K) R103.2
NetDS33_1: DS33.1(K) DS33.3(K) DS33.4(K) R92.2
NetDS34_1: DS34.1(K) DS34.3(K) DS34.4(K) R93.2
NetDS35_1: DS35.1(K) DS35.3(K) DS35.4(K) R104.2
NetDS36_1: DS36.1(K) DS36.3(K) DS36.4(K) R105.2
NetDS37_1: DS37.1(K) DS37.3(K) DS37.4(K) R94.2
NetDS38_1: DS38.1(K) DS38.3(K) DS38.4(K) R95.2
NetDS39_1: DS39.1(K) DS39.3(K) DS39.4(K) R106.2
NetDS40_1: DS40.1(K) DS40.3(K) DS40.4(K) R107.2
NetDS41_1: DS41.1(K) DS41.3(K) DS41.4(K) R96.2
NetDS42_1: DS42.1(K) DS42.3(K) DS42.4(K) R97.2
NetDS43_1: DS43.1(K) DS43.3(K) DS43.4(K) R108.2
NetDS44_1: DS44.1(K) DS44.3(K) DS44.4(K) R109.2
NetDS45_1: DS45.1(K) DS45.3(K) DS45.4(K) R98.2
NetDS46_1: DS46.1(K) DS46.3(K) DS46.4(K) R99.2
NetDS47_1: DS47.1(K) DS47.3(K) DS47.4(K) R110.2
NetDS48_1: DS48.1(K) DS48.3(K) DS48.4(K) R111.2
NetDS49_1: DS49.1(A) Q1.4(G) R28.2
NetDS50_1: DS50.1(A) Q2.4(G) R40.2
NetJ3_1: J3.1(.125_AMP-IN) J7.1(.125_AMP-IN) R5.2 U3.7(CANH)
NetJ4_1: J4.1(.125_AMP-IN) J8.1(.125_AMP-IN) R5.1 U3.6(CANL)
NetJ11_1: J11.1(.125_AMP-IN) R128.1
NetQ1_5: Q1.5(D) Q1.6(D) Q1.7(D) Q1.8(D) R46.1 R47.1 R48.1 R49.1 R50.1 R51.1 R52.1 R53.1 R54.1 R55.1 R56.1 R57.1 R88.1 R89.1 R90.1 R91.1 R92.1 R93.1 R94.1 R95.1 R96.1 R97.1 R98.1 R99.1
NetQ2_5: Q2.5(D) Q2.6(D) Q2.7(D) Q2.8(D) R58.1 R59.1 R60.1 R61.1 R62.1 R63.1 R64.1 R65.1 R66.1 R67.1 R68.1 R69.1 R100.1 R101.1 R102.1 R103.1 R104.1 R105.1 R106.1 R107.1 R108.1 R109.1 R110.1 R111.1
NetQ3_3: Q3.3(D) R16.1 U10.5(~{SHUTDOWN})
NetR2_2: R2.2 U1.1(~{HOLD}) U4.1(~{HOLD}) U8.1(~{HOLD}) U9.1(~{HOLD})
NetR7_2: R7.2 R9.1 U6.6(FB)
NetR8_1: R8.1 R29.1 U2.50(OSC2/CLK0/RC15) U13.2(A)
NetR13_2: R13.2 U10.17(BSP)
NetR17_2: R17.2 R18.1 U11.6(FB)
NetR20_2: R20.2 U11.7(~{ON}/OFF)
NetR22_1: R22.1 R128.2 U12.2 U12.3
NetR31_2: R31.2 U10.8(BSN)
NetR33_2: R33.2 U10.20(ROSC)
NetR35_2: R35.2 U2.67(OC6/CN14/RD5) U17.2(DATA)
NetR36_2: R36.2 U18.3(+)
NetR130_2: R130.2 U6.7(~{ON}/OFF)
NetU2_16: U2.16(AN4/IC7/CN6/RB4) U10.4(GAIN1)
NetU2_17: U2.17(AN3/CN5/RB3) U10.3(GAIN0)
NetU2_62: U2.62(OC3/RD2) U14.3(~{CS})
NetU2_63: U2.63(OC4/RD3) U14.4(DIN)
NetU2_66: U2.66(OC5/CN13/RD4) U14.5(SCLK)
NetU14_1: U14.1 U15.1(OUT) U15.4(-)

Not connected (* = marked no-connect by the designer): D2 1(NC); D7 1(NC); J13 5(SHLD) 6(SHLD); J14 6; U2 2(T2CK/RC1) 3(T3CK/RC2) 6(SCK2/CN8/RG6) 7(SDI2/CN9/RG7) 8(SDO2/CN10/RG8) 10(~{SS2}/CN11/RG9) 15(AN5/IC8/CN7/RB5) 21(PGC/EMUC/AN6/OCFA/RB6) 22(PGD/EMUD/AN7/RB7) 27(AN8/RB8) 28(AN9/RB9) 29(AN10/RB10) 30(AN11/RB11) 33(AN12/RB12) 37(IC7/CN20/RD14) 38(IC8/CN21/RD15) 41(U1TX/RF3) 42(U1RX/RF2) 47(SCL/RG2) 54(IC1/RD8) 55(IC2/RD9) 56(IC3/RD10) 57(IC4/RD11) 59(EMUD1/SOSCI/CN1/RC13) 60(EMUC1/SOSCO/T1CK/CN0/RC14) 64(IC5/RD12) 65(IC6/CN19/RD13) 68(OC7/CN15/RD6); U3 5(VREF); U5 7(AOUTL); U6 5(NC); U11 5(NC); U12 5 6; U16 1(DCD) 2(RI) 11(~{SUSPEND}) 12(SUSPEND) 23(CTS) 24(RTS) 27(DSR) 28(DTR)

## Notes on the sheet
- (near R9) SUPPLY DESIGNED FOR 1.5A
- (near R18) SUPPLY DESIGNED FOR 1.5A
- (near R88) .05 W
- (near R46) .05 W
- 2.2V 20mA 44mW
- 3.4V 20mA 68mW
- (near R5) TERMINATE MASTER ONLY
- hfe 100+ 0.3V
- (near R48) .05 W
- (near R90) .05 W
- (near R5) MASTER ONLY
- (near J4) DAISY CHAIN CONNECTORS
- (near R50) .05 W
- (near R92) .05 W
- PIEZO+
- PIEZO -
- (near J9) SPEAKER +
- (near R52) .05 W
- (near R94) .05 W
- (near J10) SPEAKER -
- (near J14) PROGRAMMING PORT
- (near JP1) For Original NEOS:
  OptionJumpers=((PORTA & 0x600) >> 7) | ((PORTA & 0xC0) >> 6);
  Display Configuration: RB10 and RB11 Shorted.  V.1.29 of Software Sets RB10 and verifies a Read on RB11
  Master Configuration:   JP3 and JP4 populated OptionJumpers=0xc
  Slave  Configuration:  Anything else.  Software comments an OptionJumpers=0x4 which is populating JP1, JP3 and JP4
- (near R96) .05 W
- (near R54) .05 W
- MASTER ID RESISTOR
- SCORE DISPLAY ID RESISTOR
- FOSC=12.288E6
- (near U2) USE /3 INP & PLL * 8 = 32.7696E6
- (near U2) FCY= /4 = 8.1924E6, TCY = 122E-9
- MIPS=8.192
- FCAN=FCY=8.1924E6
- (near U2) CANCKS=1 FOR /4 BECAUSE >7.5MHz
- TQ=125ns
- UNIQUE ID
- (near R56) .05 W
- (near R98) .05 W
- LM4861 Shutdown 0.6uA
- SN65HVD230 Standby 370uA
- SN74HC595DW spec 80uA @ 6V * 4 - Probably much less at 3.3
- CS4344 100uA with clk/data static
- dsPIC ???
- MMA7260 500uA & only 3uA sleep
- SEPARATE PATHS FOR LED VCC/GND
- NEOS Master/Slave Electronics
- M25P64 50uA in stby
- LM2676 at least 4.2mA + switching loss
- SEPARATE PATHS FOR AUDIO AMP VCC/GND
- ELC0100
- 1
- A.S.
- 3
- Labels drawn without touching a wire or pin: GND

## Library data of the parts
C1 C3 C4 C8-C11 C13 C27 C32-C34 C37 C47 C49-C55 = C: Manufacturer: Murata Electronics North America; Manufacturer Part Number: GRM188R71E104KA01D; Source Part Number: 490-1524-1-ND; Source: DIGIKEY; ROHS Certificate: ROHS-MURATA-CHIP-CAPS.pdf
C2 C14 C19 C24 C25 C28 = C: Manufacturer: Murata Electronics North America; Manufacturer Part Number: GRM31CR61E106KA12L; Source Part Number: 490-3373-1-ND; Source: DIGIKEY; ROHS Certificate: ROHS-MURATA-CHIP-CAPS.pdf
C5 C7 = C#S/T491X476K035ATK: CAPACITOR TANT 47UF 35V 10% SMD 7343-43 (EIA); Manufacturer: Kemet; Source Part Number: 399-3821-1-ND; Value: 47uF 35V; Manufacturer Part Number: T491X476K035AT; Source: Digikey; ROHS Certificate: ROHS-KEMET-TANTALUM.pdf
  C7: Value: Value
C6 = C#S/C0805C104K5RACK: CAP .10UF 50V CERAMIC X7R 0805; Manufacturer: Kemet; Manufacturer Part Number: C0805C104K5RACTU; Source Part Number: 399-1170-1-ND; Source: Digikey; ROHS Certificate: ROHS-KEMET-CERAMIC.PDF; Value: CAP .10UF 50V CERAMIC X7R 0805
C12 C26 = C#S/C0805C103K5RAC: CAP 10000PF 50V CERAMIC X7R 0805; Manufacturer: Kemet; Manufacturer Part Number: C0805C103K5RACTU; Source Part Number: 399-1158-1-ND; Source: Digikey; ROHS Certificate: ROHS-KEMET-CERAMIC.PDF; Value: CAP 10000PF 50V CERAMIC X7R 0805
C15 C17 C23 C29 C39 C40 C43 C44 C48 = C: CAP CER 1.0UF 16V 20% X7R 0805; Manufacturer: Murata Electronics North America; Manufacturer Part Number: GRM21BR71C105MA01L; Source Part Number: 490-1692-1-ND; Source: DIGIKEY; ROHS Certificate: ROHS-MURATA-CHIP-CAPS.pdf
C16 C20 = C#S/C0805C180J5GACTUK: CAP CERAMIC 18PF 50V NP0 0805; Manufacturer: Kemet; Source Part Number: 399-1112-1-ND; Manufacturer Part Number: C0805C180J5GACTU; Source: Digikey; ROHS Certificate: ROHS-KEMET-CERAMIC.pdf; Value: CAP CERAMIC 18PF 50V NP0 0805
C18 C22 C30 C31 = C#S/T495D686K016ATEK: CAPACITOR TANT 68UF 16V 10% SMD; Manufacturer: Kemet; Manufacturer Part Number: T495D686K016ATE150; Source Part Number: 399-3889-1-ND; Value: CAPACITOR TANT 68UF 16V 10% SMD; Source: Digikey; ROHS Certificate: ROHS-KEMET-TANTALUM.pdf
  C22 C30: Value: Value
C21 = C#S/EEEFK1C100RP: CAP ELECT 10UF 16V FK SMD; Manufacturer: Panasonic - ECG; Manufacturer Part Number: EEE-FK1C100R; Source Part Number: PCE3782CT-ND; Source: Digikey; ROHS Certificate: ROHS-PANASONIC.pdf; Value: CAP ELECT 10UF 16V FK SMD
C35 C36 C38 C41 = C: Manufacturer: Panasonic - ECG; Manufacturer Part Number: ECJ-2YB1E224K; Source Part Number: PCC1832CT-ND; Source: DIGIKEY; ROHS Certificate: ROHS-PANASONIC.pdf
C42 = C: Manufacturer: Murata Electronics North America; Manufacturer Part Number: GRM1885C1H221JA01D; Source Part Number: 490-1435-1-ND; Source: DIGIKEY; ROHS Certificate: ROHS-MURATA-CHIP-CAPS.pdf
D1 = D#S/MURS360T3GM: Manufacturer: ON Semiconductor; Source Part Number: MURS360T3GOSCT-ND; Manufacturer Part Number: MURS360T3G; Source: Digikey; ROHS Certificate: ROHS-ON-SEMI.PDF
D2 D7 = D#S/8TQ080SPBFZ: DIODE SCHOTTKY 80V 8A D2PAK; Manufacturer: Vishay IR; Source Part Number: 8TQ080SPBF-ND; Manufacturer Part Number: 8TQ080SPBF; Source: Digikey; ROHS Certificate: ROHS-IRF.pdf; Value: DIODE SCHOTTKY 80V 8A D2PAK
D3-D5 = D#S/BAS167F0D: Diodes Inc BAS16 75V 200mA; Manufacturer Part Number: BAS16-7-F; Manufacturer: Diodes Inc; Source: Digikey; Source Part Number: BAS16-7-F; ROHS Certificate: ROHS-DIODES-INC.pdf; Value: Diodes Inc BAS16 75V 200mA
D6 = B350A-13-F: Source Part Number: B350A-FDICT-ND; Manufacturer: Diodes Inc; Source: Digikey; Manufacturer Part Number: B350A-13-F; ROHS Certificate: ROHS-DIODE-INC.pdf; Value: DIODE SCHOTTKY 3A 50V SMA
D8 D9 = MURA110T3G: Manufacturer: ON Semiconductor; Source Part Number: MURA110T3GOSCT-ND; Manufacturer Part Number: MURA110T3G; Source: Digikey; ROHS Certificate: ROHS-ON-SEMI.pdf; Value: MURA110T3G
DS1 DS2 DS5 DS6 DS9 DS10 DS13 DS14 DS17 DS18 DS21 DS22 DS25 DS26 DS29 DS30 DS33 DS34 DS37 DS38 DS41 DS42 DS45 DS46 = L#S/TLMK3210: Vishay Red LED PLCC-3; Manufacturer Part Number: TLMK3210-GS08; Value: Power SMD LED Lamp AllnGaP PLCC-3 Red 2.2V 70mA 60 deg.; Manufacturer: Vishay; Source: Future; Source Part Number: TLMK3210-GS08; ROHS Certificate: ROHS-VISHAY.pdf
DS3 DS4 DS7 DS8 DS11 DS12 DS15 DS16 DS19 DS20 DS23 DS24 DS27 DS28 DS31 DS32 DS35 DS36 DS39 DS40 DS43 DS44 DS47 DS48 = L#S/LM1PPG103N1Z: 120-degree, 3.3 x 3.5-mm, SMT LED in green color with water-transparent lens; Manufacturer: Cree; Manufacturer Part Number: LM1-PPG1-01-N1; Source: Marktech Optoelectronics; Source Part Number: LM1-PPG1-01-N1; ROHS Certificate: ROHS-CREE.pdf; Value: 120-degree, 3.3 x 3.5-mm, SMT LED in green color with water-transparent lens
DS49 = LRCOVLFR3C7Z: LED 631NM TAPERED RED 5MM; Manufacturer: TT Electronics/Optek Technology; Manufacturer Part Number: OVLGS0C8B9; Source Part Number: 365-1189-ND; Source: Digikey; ROHS Certificate: ROHS-OPTEK.pdf; Value: LED 631NM TAPERED RED 5MM
DS50 = LGCOVLFG3C7Z: LED 525NM ROUND GREEN 5MM; Manufacturer: TT Electronics/Optek Technology; Source Part Number: 365-1181-ND; Manufacturer Part Number: OVLFG3C7; Source: Digikey; ROHS Certificate: ROHS-OPTEK.pdf; Value: LED 525NM ROUND GREEN 5MM
J1-J12 = ~125_WIRE: Manufacturer: Manufacturer; Manufacturer Part Number: Manufacturer Part Number; Source: Source; Source Part Number: Source Part Number; ROHS Certificate: ROHS Certificate; Value: Value
J13 = 787834-2: USB Connectors B TYPE VERT BLK SKT; Manufacturer: Kycon; Source Part Number: 806-KUSBVX-BS1N-B; Manufacturer Part Number: KUSBVX-BS1N-B; Source: Mouser; ROHS Certificate: ROHS-KYCON.pdf; Value: USB Connectors B TYPE VERT BLK SKT
J14 = JCPM5086VE0Z: CONN HEADER VERT 6POS 5.08MM; Source Part Number: 277-1154-ND; Manufacturer: Phoenix Contact; Manufacturer Part Number: 1755778; Source: Digikey; ROHS Certificate: ROHS-PHOENIX.pdf; Value: CONN HEADER VERT 6POS 5.08MM
JP1-JP4 = RS/ERJ6ENF: RES 0.0 OHM 1/8W 5% 0805 SMD; Manufacturer: Panasonic - ECG; Manufacturer Part Number: ERJ-6GEY0R00V; Source Part Number: P0.0ACT-ND; Value: RES 0.0 OHM 1/8W 5% 0805 SMD; Source: Digikey; ROHS Certificate: ROHS-PANASONIC.pdf
  JP1 JP2: Value: Value
L1 L2 = N#S/DO5022P333Z: 33uH 3A Surface Mount Inductor; Manufacturer: CoilCraft; Manufacturer Part Number: DO5022P-333MLB; Value: 33uH 3A Surface Mount; Source: CoilCraft; Source Part Number: DO5022P-333MLB; ROHS Certificate: ROHS-COILCRAFT-DO5022.pdf; Value: Value
L3 L4 = L_PANASONIC_ELL: Manufacturer: Panasonic - ECG; Manufacturer Part Number: ELL-6SH220M; Source Part Number: PCD1374CT-ND; Source: Digikey; ROHS Certificate: ROHS-PANASONIC.pdf
M1-M4 = MountingHole_1/4: Manufacturer: Manufacturer; Manufacturer Part Number: Manufacturer Part Number; Source: Source; Source Part Number: Source Part Number; ROHS Certificate: ROHS Certificate; Value: Value
M5-M10 = MountingHole_8: Manufacturer: Manufacturer; Manufacturer Part Number: Manufacturer Part Number; Source: Source; Source Part Number: Source Part Number; ROHS Certificate: ROHS Certificate; Value: Value
Q1 Q2 = Q#S/FDS8884F: MOSFET N-CH 30V 8.5A 8-SOIC; Manufacturer: Fairchild Semiconductor; Source Part Number: FDS8884CT-ND; Manufacturer Part Number: FDS8884; Source: Digikey; ROHS Certificate: ROHS-FAIRCHILD.pdf; Value: MOSFET N-CH 30V 8.5A 8-SOIC
Q3 = FDV301: MOSFET N-CH 25V 220MA SOT-23; Manufacturer: Fairchild Semiconductor; Manufacturer Part Number: FDV301N; Source Part Number: FDV301NCT-ND; Source: Digikey; ROHS Certificate: ROHS-FAIRCHILD.pdf; Value: FDV301
R1-R3 R6 R10 R11 R14 R16 R19 R21 R23 R26 R27 R30 R34 R37 = RS/ERJ6ENF: RES 100K OHM 1/8W 1% 0805 SMD; Manufacturer: Panasonic - ECG; Manufacturer Part Number: ERJ-6ENF1003V; Source Part Number: P100KCCT-ND; Value: RES 100K OHM 1/8W 1% 0805 SMD; Source: Digikey; ROHS Certificate: ROHS-PANASONIC.pdf
R4 R15 R20 R28 R32 R40 R112 R130 = RS/ERJ6ENF: RES 10.0K OHM 1/8W 1% 0805 SMD; Manufacturer: Panasonic - ECG; Manufacturer Part Number: ERJ-6ENF1002V; Value: RES 10.0K OHM 1/8W 1% 0805 SMD; Source: Digikey; Source Part Number: RES 10.0K OHM 1/8W 1% 0805 SMD; ROHS Certificate: ROHS-PANASONIC.pdf
R5 = RS/ERJ8ENF: RES 121 OHM 1/4W 1% 1206 SMD; Manufacturer: Panasonic - ECG; Manufacturer Part Number: ERJ-8ENF1210V; Source Part Number: P121FCT-ND; Value: RES 121 OHM 1/4W 1% 1206 SMD; Source: Digikey; ROHS Certificate: ROHS-PANASONIC.pdf
R7 R17 = RS/ERJ6ENF: RES 1.00K OHM 1/8W 1% 0805 SMD; Manufacturer: Panasonic - ECG; Manufacturer Part Number: ERJ-6ENF1001V; Source Part Number: P1.00KCTR-ND; Value: RES 1.00K OHM 1/8W 1% 0805 SMD; Source: Digikey; ROHS Certificate: ROHS-PANASONIC.pdf
R8 R22 R29 = RS/ERJ6GEYJ: RES 0.0 OHM 1/8W 5% 0805 SMD; Manufacturer: Panasonic - ECG; Manufacturer Part Number: ERJ-6GEY0R00V; Source Part Number: P0.0ACT-ND; Value: RES 0.0 OHM 1/8W 5% 0805 SMD; Source: Digikey; ROHS Certificate: ROHS-PANASONIC.pdf
R9 R128 = RS/ERJ6ENF: RES 3.16K OHM 1/8W 1% 0805 SMD; Manufacturer: Panasonic - ECG; Manufacturer Part Number: ERJ-6ENF3161V; Source Part Number: P3.16KCCT-ND; Value: RES 3.16K OHM 1/8W 1% 0805 SMD; Source: Digikey; ROHS Certificate: ROHS Certificate
R12 R36 = RS/ERJ6ENF: RES 390 OHM 1/8W 5% 0805 SMD; Manufacturer: Panasonic - ECG; Manufacturer Part Number: ERJ-6GEYJ391V; Source Part Number: P390ACT-ND; Value: RES 390 OHM 1/8W 5% 0805 SMD; Source: Digikey; ROHS Certificate: ROHS-PANASONIC.pdf
R13 R31 = RS/ERJ6ENF: Manufacturer: Panasonic - ECG; Manufacturer Part Number: ERJ-6GEYJ124V; Source Part Number: P51.0CCT-ND; Source: Digikey; ROHS Certificate: ROHS-PANASONIC.pdf
R18 = RS/ERJ6ENF: RES 1.65K OHM 1/8W 1% 0805 SMD; Manufacturer Part Number: ERJ-6ENF1651V; Source Part Number: P1.65KCCT-ND; Manufacturer: Panasonic - ECG; Value: RES 1.65K OHM 1/8W 1% 0805 SMD; Source: Digikey; ROHS Certificate: ROHS Certificate
R24 = RS/ERJ6ENF: RES 7.50K OHM 1/8W 1% 0805 SMD; Manufacturer: Panasonic - ECG; Manufacturer Part Number: ERJ-6ENF7501V; Source Part Number: P7.50KCCT-ND; Value: RES 7.50K OHM 1/8W 1% 0805 SMD; Source: Digikey; ROHS Certificate: ROHS-PANASONIC.pdf
R25 = RS/ERJ6ENF: RES 2.49K OHM 1/8W 1% 0805 SMD; Manufacturer: Panasonic - ECG; Manufacturer Part Number: ERJ-6ENF2491V; Source Part Number: P2.49KCCT-ND; Value: RES 2.49K OHM 1/8W 1% 0805 SMD; Source: Digikey; ROHS Certificate: ROHS-PANASONIC.pdf
R33 = RS/ERJ6ENF: Manufacturer: Panasonic - ECG; Manufacturer Part Number: ERJ-6GEYJ124V; Source Part Number: P120KACT-ND; Source: Digikey; ROHS Certificate: ROHS-PANASONIC.pdf
R35 = RS/ERJ6ENF: RES 4.7K OHM 1/8W 5% 0805 SMD; Manufacturer: Panasonic - ECG; Manufacturer Part Number: RC0805JR-074K7L; Source Part Number: 311-4.7KARCT-ND; Value: 4.7k; Source: Digikey; ROHS Certificate: ROHS-PANASONIC.pdf
R46-R57 R88-R99 = RS/ERJ8ENF: RES 15.0 OHM 1/4W 1% 1206 SMD; Manufacturer: Panasonic - ECG; Manufacturer Part Number: ERJ-8ENF15R0V; Source Part Number: P15.0FTR-ND; Value: RES 15.0 OHM 1/4W 1% 1206 SMD; Source: Digikey; ROHS Certificate: ROHS-PANASONIC.pdf
  R88-R99: Value: Value
R58-R69 R100-R111 = RS/ERJ8ENF: RES 32.4 OHM 1/4W 1% 1206 SMD; Manufacturer: Panasonic - ECG; Manufacturer Part Number: ERJ-8ENF32R4V; Source Part Number: P32.4FTR-ND; Value: RES 32.4 OHM 1/4W 1% 1206 SMD; Source: Digikey; ROHS Certificate: ROHS-PANASONIC.pdf
  R100-R111: Value: Value
R129 = RS/ERJ6ENF: RES 20.0K OHM 1/8W 1% 0805 SMD; Manufacturer: Panasonic - ECG; Manufacturer Part Number: ERJ-6ENF2002V; Source Part Number: P20.0KCCT-ND; Source: Digikey; ROHS Certificate: ROHS-PANASONIC.pdf; Value: RES 20.0K OHM 1/8W 1% 0805 SMD
U1 U4 U8 U9 = IS/M25P64VMF6GZ: 64 MBit Serial SPI NOR FLASH; Manufacturer: STMicroelectronics / Numonyx; Manufacturer Part Number: M25P64-VMF6P; Source: Mouser; Source Part Number: M25P64-VMF6P; ROHS Certificate: ROHS-NUMONYX.pdf; Value: 64 MBit Serial SPI NOR FLASH
U2 = IS/DSPIC30F501320IPTZ_1: IC DSPIC MCU/DSP 144K 80TQFP; Manufacturer: Microchip Technology; Manufacturer Part Number: DSPIC30F6014A-30I/PT; Source Part Number: DSPIC30F6014A30IP-ND; Source: Digikey; ROHS Certificate: ROHS-MICROCHIP.pdf; Value: IC DSPIC MCU/DSP 144K 80TQFP
U3 = IS/SN65HVD230DRT: IC 3.3V CAN TXRX W/STNDBY 8-SOIC; Manufacturer: Texas Instruments; Source Part Number: 296-11654-2-ND; Manufacturer Part Number: SN65HVD230DR; Source: Digikey; ROHS Certificate: ROHS-SN65HVD230DR.pdf; Value: IC 3.3V CAN TXRX W/STNDBY 8-SOIC
U5 = IS/CS4344CZZZ: IC DAC 24BIT 192KHZ 10-TSSOP; Manufacturer: Cirrus Logic Inc; Source Part Number: 598-1051-5-ND; Manufacturer Part Number: CS4344-CZZ; Source: Digikey; ROHS Certificate: ROHS-CIRRUS-LOGIC.pdf; Value: IC DAC 24BIT 192KHZ 10-TSSOP
U6 U11 = IS/LM2676SADJN: IC REG SIMPLE SWITCHER TO-263-7; Manufacturer: National Semiconductor; Source Part Number: LM2676S-ADJ-ND; Manufacturer Part Number: LM2676S-ADJ/NOPB; Source: Digikey; ROHS Certificate: ROHS-LM2676SD-ADJNOPB.pdf; Value: IC REG SIMPLE SWITCHER TO-263-
U7 = IS/LP2950CDT33N: IC REG VOLT MICROPWR 3.3V TO-252; Manufacturer: National Semiconductor; Manufacturer Part Number: LP2950CDT-3.3/NOPB; Source Part Number: LP2950CDT-3.3-ND; Source: Digikey; ROHS Certificate: ROHS-LP2950CDT-3.3NOPB.pdf; Value: IC REG VOLT MICROPWR 3.3V TO-252
U10 = TPA3001D1: Source Part Number: 296-14200-1-ND; Manufacturer: Texas Instruments; Manufacturer Parrt Number: TPA3001D1PWPR; Value: TPA3001D1PWPR; Source: Digikey; ROHS Certificate: ROHS_TI_TPA3001D1PWPR.pdf
U12 = I#S/MOCD207MZ: OPTOCOUPLER TRANS-OUT 2CH 8-SOIC; Manufacturer: Fairchild Optoelectronics Group; Source Part Number: MOCD207M-ND; Manufacturer Part Number: MOCD207M; Source: Digikey; ROHS Certificate: ROHS-FAIRCHILD.pdf; Value: OPTOCOUPLER TRANS-OUT 2CH 8-SOIC
U13 = I#S/SN74AHC1G125DBVT: TI Tri State Buffer Single Gate; Manufacturer: Texas Instruments; Source Part Number: 296-8744-1-ND; Manufacturer Part Number: SN74AHC1G125DBVR; Source: Digikey; ROHS Certificate: ROHS-TI.pdf; Value: SN74AHC1G125DBVR
U14 = MAX5401: Manufacturer: Maxim Integrated Products; Manufacturer Part Number: MAX5401EKA+T; Source Part Number: MAX5401EKA+TCT-ND; Value: MAX5401EKA+T; Source: Digikey; ROHS Certificate: ROHS-MAXIM.pdf
U15 = OPA333: Manufacturer: Texas Instruments; Manufacturer Part Number: OPA333AIDBVT; Source Part Number: 296-19546-2-ND; Value: OPA333; Source: DIGIKEY; ROHS Certificate: ROHS-TI.pdf
U16 = CP2102: Source Part Number: 336-1160-ND; Manufacturer: Silicon Laboratories Inc; Manufacturer Part Number: CP2102-GM; Value: CP2102; Source: Digikey
U17 = DS2401P+: Source Part Number: DS2401P+-ND; Manufacturer: Dallas Semiconductor; Source: Digikey; Manufacturer Part Number: DS2401P+; ROHS Certificate: ROHS-DS2401P+.pdf; Value: DS2401P+
U18 = OPA340: Manufacturer: Texas Instruments; Manufacturer Part Number: OPA340NA/250; Source Part Number: OPA340NACT-ND; Source: Digikey; ROHS Certificate: ROHS-TI.pdf
Y1 = ZS/ECS1228205PTRZ: CRYSTAL 8.192MHZ 18PF FUND SMD; Manufacturer: Abracon Corporation; Manufacturer Part Number: ABLS-8.192MHZ-B2-T; Source Part Number: 535-9090-2-ND; Source: Digikey; ROHS Certificate: ROHS-ABRACON.pdf; Value: CRYSTAL 8.192MHZ 18PF FUND SMD
FID1-FID8 = Fiducial: Manufacturer: Manufacturer; Manufacturer Part Number: Manufacturer Part Number; Source: Source; Source Part Number: Source Part Number; ROHS Certificate: ROHS Certificate; Value: Value